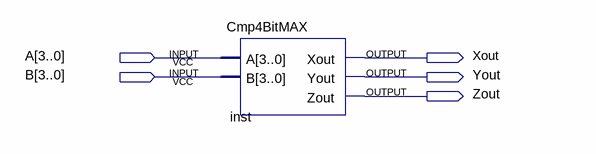
[diagram p0: schematic sheet]
// Quartus schematic CmpDemoMAX.bdf as structural Verilog: 1 symbols, 5 pins
module CmpDemoMAX (
  input  [3:0] A,
  input  [3:0] B,
  output Xout,
  output Yout,
  output Zout
);

  Cmp4BitMAX inst (.A(A), .B(B), .Xout(Xout), .Yout(Yout), .Zout(Zout));
endmodule
